# EAGLE schematic BlueTooth BM20 Breakout (EAGLE 9.6.2)
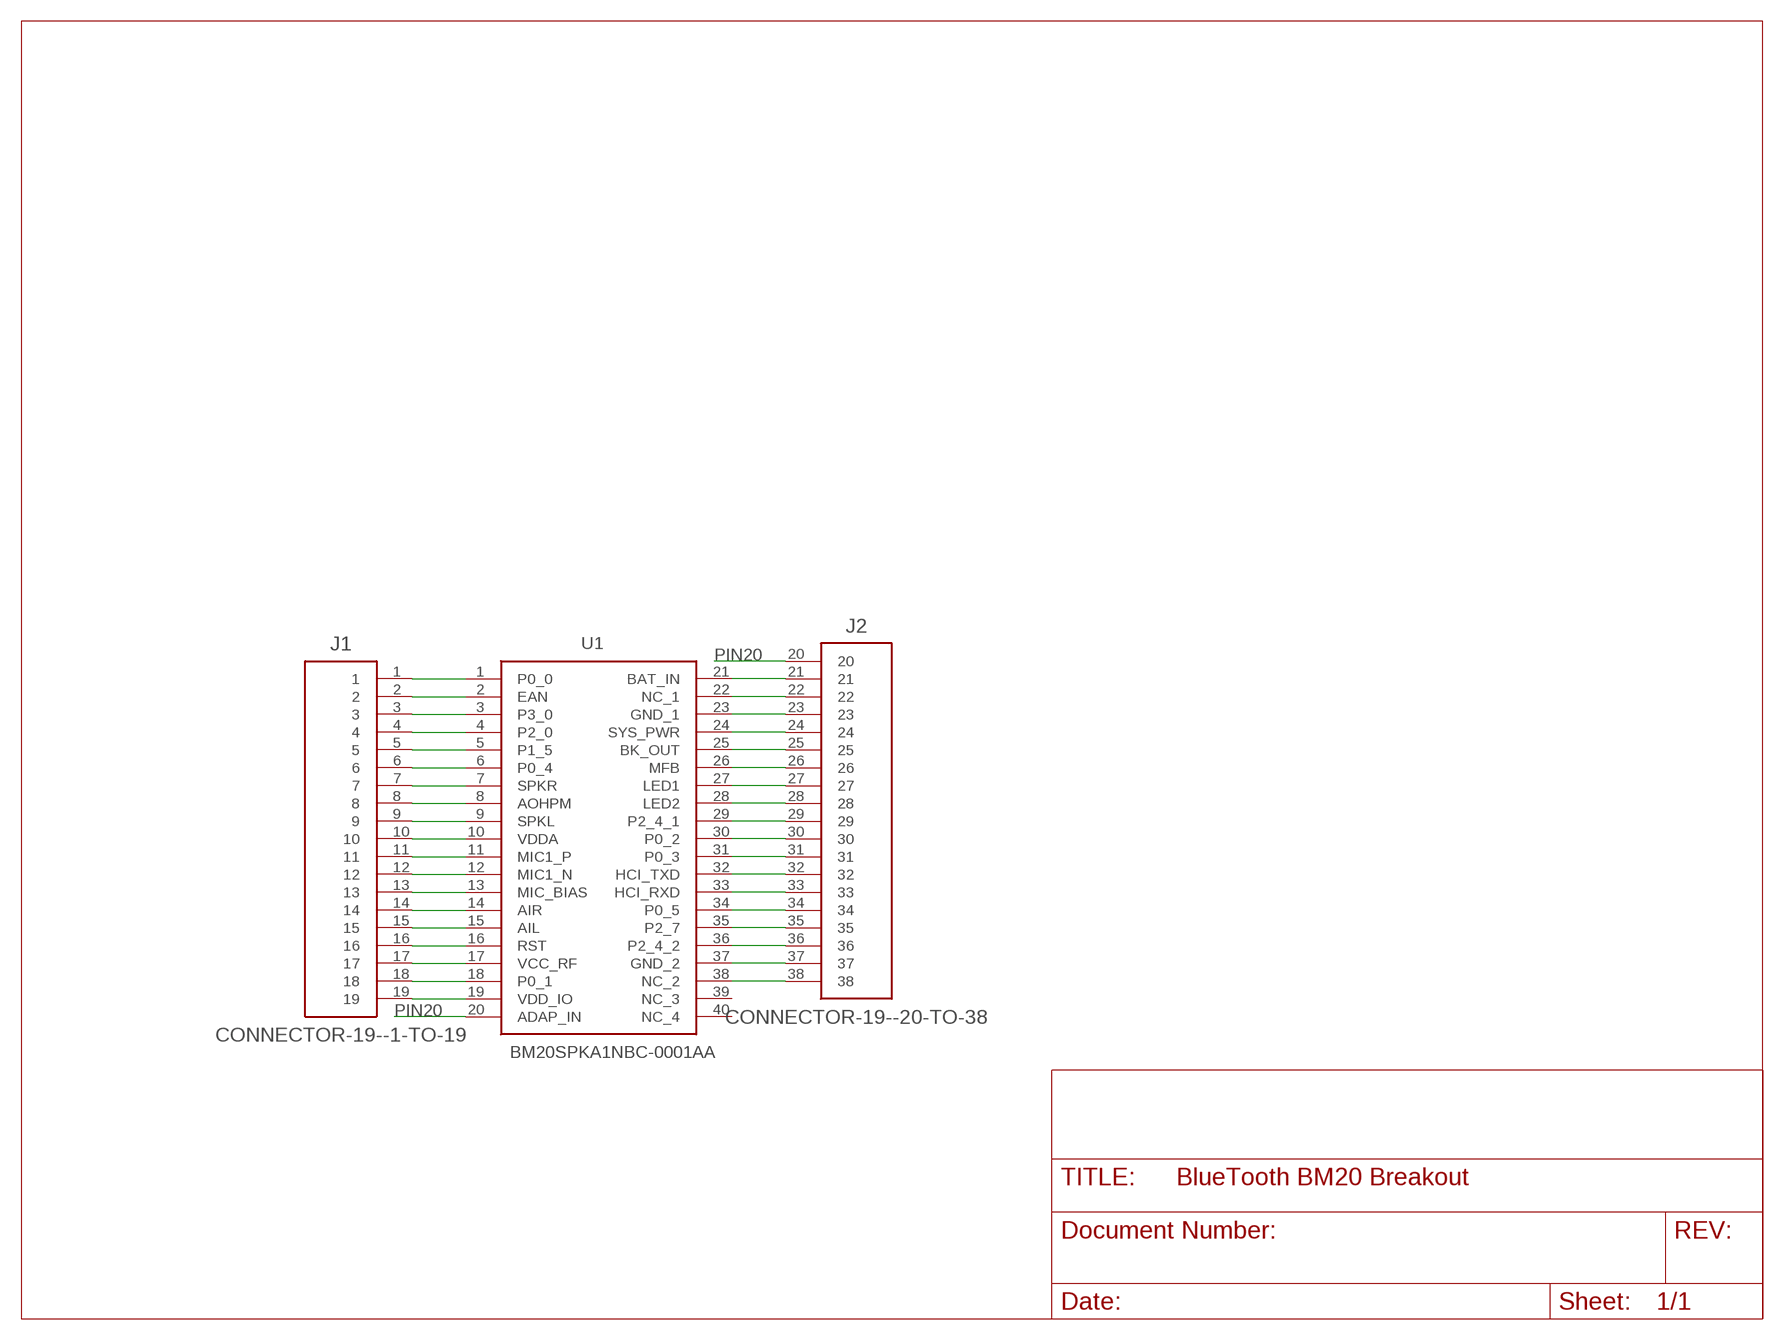
[diagram p0: schematic, sheet 1]

## Parts
J1  CONNECTOR-19--1-TO-19  [ESQ-119-XX-XX-S]
J2  CONNECTOR-19--20-TO-38  [ESQ-119-XX-XX-S--PIN-1-ROUND]
U1  BM20SPKA1NBC-0001AA  [BM20SPKA1NBC0001AA]

## Nets
N$1: J1.4 U1.4(P2_0)
N$2: J1.1 U1.1(P0_0)
N$3: J1.5 U1.5(P1_5)
N$4: J1.2 U1.2(EAN)
N$5: J1.6 U1.6(P0_4)
N$6: J1.3 U1.3(P3_0)
N$7: J1.7 U1.7(SPKR)
N$8: J1.8 U1.8(AOHPM)
N$9: J1.9 U1.9(SPKL)
N$10: J1.10 U1.10(VDDA)
N$11: J1.11 U1.11(MIC1_P)
N$12: J1.12 U1.12(MIC1_N)
N$13: J1.13 U1.13(MIC_BIAS)
N$14: J1.14 U1.14(AIR)
N$15: J1.15 U1.15(AIL)
N$16: J1.16 U1.16(RST)
N$17: J1.17 U1.17(VCC_RF)
N$18: J1.18 U1.18(P0_1)
N$19: J1.19 U1.19(VDD_IO)
N$20: J2.23 U1.23(GND_1)
N$21: J2.24 U1.24(SYS_PWR)
N$22: J2.21 U1.21(BAT_IN)
N$23: J2.25 U1.25(BK_OUT)
N$24: J2.22 U1.22(NC_1)
N$25: J2.26 U1.26(MFB)
N$26: J2.27 U1.27(LED1)
N$27: J2.28 U1.28(LED2)
N$28: J2.29 U1.29(P2_4_1)
N$29: J2.30 U1.30(P0_2)
N$30: J2.31 U1.31(P0_3)
N$31: J2.32 U1.32(HCI_TXD)
N$32: J2.33 U1.33(HCI_RXD)
N$33: J2.34 U1.34(P0_5)
N$34: J2.35 U1.35(P2_7)
N$35: J2.36 U1.36(P2_4_2)
N$36: J2.37 U1.37(GND_2)
N$37: J2.38 U1.38(NC_2)
PIN20: J2.20 U1.20(ADAP_IN)
Unconnected: U1.39(NC_3) U1.40(NC_4)

## Library data of the parts
J1 = eagle-library-engr-245-s22 (1):CONNECTOR-19--1-TO-19
J2 = eagle-library-engr-245-s22 (1):CONNECTOR-19--20-TO-38
U1 = eagle-library-engr-245-s22 (1):BM20SPKA1NBC-0001AA: Bluetooth Modules (802.15.1) BT 4.1 Stereo Audio No-Shield/Antenna Source: Datasheet <https://componentsearchengine.com/Datasheets/1/BM20SPKA1NBC-0001AA.pdf>; DESCRIPTION: Bluetooth Modules (802.15.1) BT 4.1 Stereo Audio No-Shield/Antenna; HEIGHT: 2.5mm; MANUFACTURER_NAME: Microchip; MANUFACTURER_PART_NUMBER: BM20SPKA1NBC-0001AA; MOUSER_PART_NUMBER: 579-SPKA1NBC-0001AA; MOUSER_PRICE-STOCK: https://www.mouser.co.uk/ProductDetail/Microchip-Technology/BM20SPKA1NBC-0001AA?qs=uus7iwvxYD8HqvnWsd76VQ%3D%3D